# Altium schematic sheet VRail.SchDoc
size A
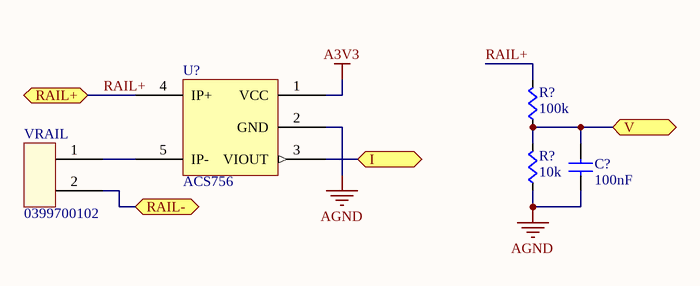
[diagram p0: VRail.SchDoc]

## Parts
(Parts that share a designator on the sheet are numbered #1, #2 ... from top to bottom, then left to right.)
C?  value 100nF  [CAPC0603]  (hidden comment: Cap)
R?#1  value 100k  [RES0603]  (hidden comment: Res)
R?#2  value 10k  [RES0603]  (hidden comment: Res)
U?  ACS756  [ACS756]
VRAIL  0399700102  [MOLEX-TERMINAL-1x2-EUROSTYLE-60A]

## Ports
I, RAIL+, RAIL-, V

## Nets
A3V3: U?.1(VCC)
AGND: C?.2(B) R?#2.2(B) U?.2(GND)
I: U?.3(VIOUT) ; port I
RAIL+: R?#1.1(A) U?.4(IP+) ; port RAIL+
RAIL-: VRAIL.2 ; port RAIL-
V: C?.1(A) R?#1.2(B) R?#2.1(A) ; port V
NetU?_5: U?.5(IP-) VRAIL.1

## Library data of the parts
U? = ACS756: Hall Effect-Based Linear Current Sensor IC; Supplier 1: Digi-Key; Supplier Part Number 1: 620-1239-ND
VRAIL = MOLEX-TERMINAL-1x2-EUROSTYLE-60A: Giant 60A two position screw terminal; Supplier 1: Digi-Key; Supplier Part Number 1: WM3193-ND
C? = Cap: Supplier 1: Digi-Key; Supplier Part Number 1: 399-1095-1-ND
R?#1 R?#2 = Res: Supplier 1: Digi-Key
  R?#1: Supplier Part Number 1: RR08P100KDCT-ND
  R?#2: Supplier Part Number 1: RR08P10.0KDCT-ND